# Altium schematic sheet DS12885.SchDoc
size A4
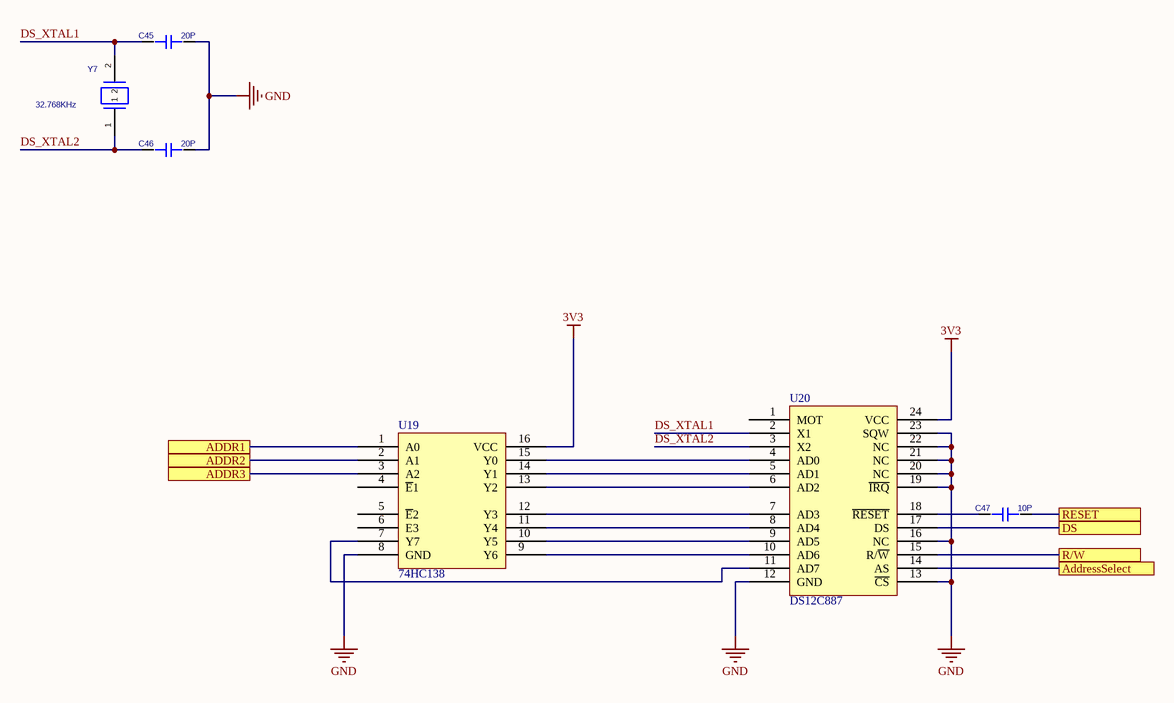
[diagram p0: DS12885.SchDoc]

## Parts
C45  value 20P  [CAP_0603_FIRE]  (hidden comment: CAP_20P_0603_FIRE)
C46  value 20P  [CAP_0603_FIRE]  (hidden comment: CAP_20P_0603_FIRE)
C47  value 10P  [RES_0603_FIRE]  (hidden comment: CAP_10P_0603_FIRE)
U19  74HC138  [74HC138]
U20  DS12C887  [DS12885]
Y7  value 32.768KHz  [3215]  (hidden comment: XTAL_32.768KHZ_3215)

## Ports
ADDR1, ADDR2, ADDR3, AddressSelect, DS, R/W, RESET

## Nets
3V3: U19.16(VCC) U20.24(VCC)
GND: C45.2 C46.2 U19.8(GND) U20.12(GND) U20.13(~{CS}) U20.16(NC) U20.19(~{IRQ}) U20.20(NC) U20.21(NC) U20.22(NC) U20.23(SQW)
ADDR1: U19.1(A0) ; port ADDR1
ADDR2: U19.2(A1) ; port ADDR2
ADDR3: U19.3(A2) ; port ADDR3
AddressSelect: U20.14(AS) ; port AddressSelect
DS: U20.17(DS) ; port DS
DS_XTAL1: C45.1 U20.2(X1) Y7.2
DS_XTAL2: C46.1 U20.3(X2) Y7.1
R/W: U20.15(R/~{W}) ; port R/W
RESET: C47.2 ; port RESET
NetC47_1: C47.1 U20.18(~{RESET})
NetU19_7: U19.7(Y7) U20.11(AD7)
NetU19_9: U19.9(Y6) U20.10(AD6)
NetU19_10: U19.10(Y5) U20.9(AD5)
NetU19_11: U19.11(Y4) U20.8(AD4)
NetU19_12: U19.12(Y3) U20.7(AD3)
NetU19_13: U19.13(Y2) U20.6(AD2)
NetU19_14: U19.14(Y1) U20.5(AD1)
NetU19_15: U19.15(Y0) U20.4(AD0)

Not connected (* = marked no-connect by the designer): U19 4(~{E}1) 5(~{E}2) 6(E3); U20 1(MOT)

## Library data of the parts
C47 = CAP_10P_0603_FIRE: 0603; Manufacture 1: SUPERCAP; Tolerance: +-5%; PCB DECAL: RES_0603_FIRE
Y7 = XTAL_32.768KHZ_3215: CRYSTAL; PCB DECAL: 3215
C45 C46 = CAP_20P_0603_FIRE: PCB DECAL: CAP_0603_FIRE